# EAGLE design mainboard-raspi-4 (EAGLE 6.4)
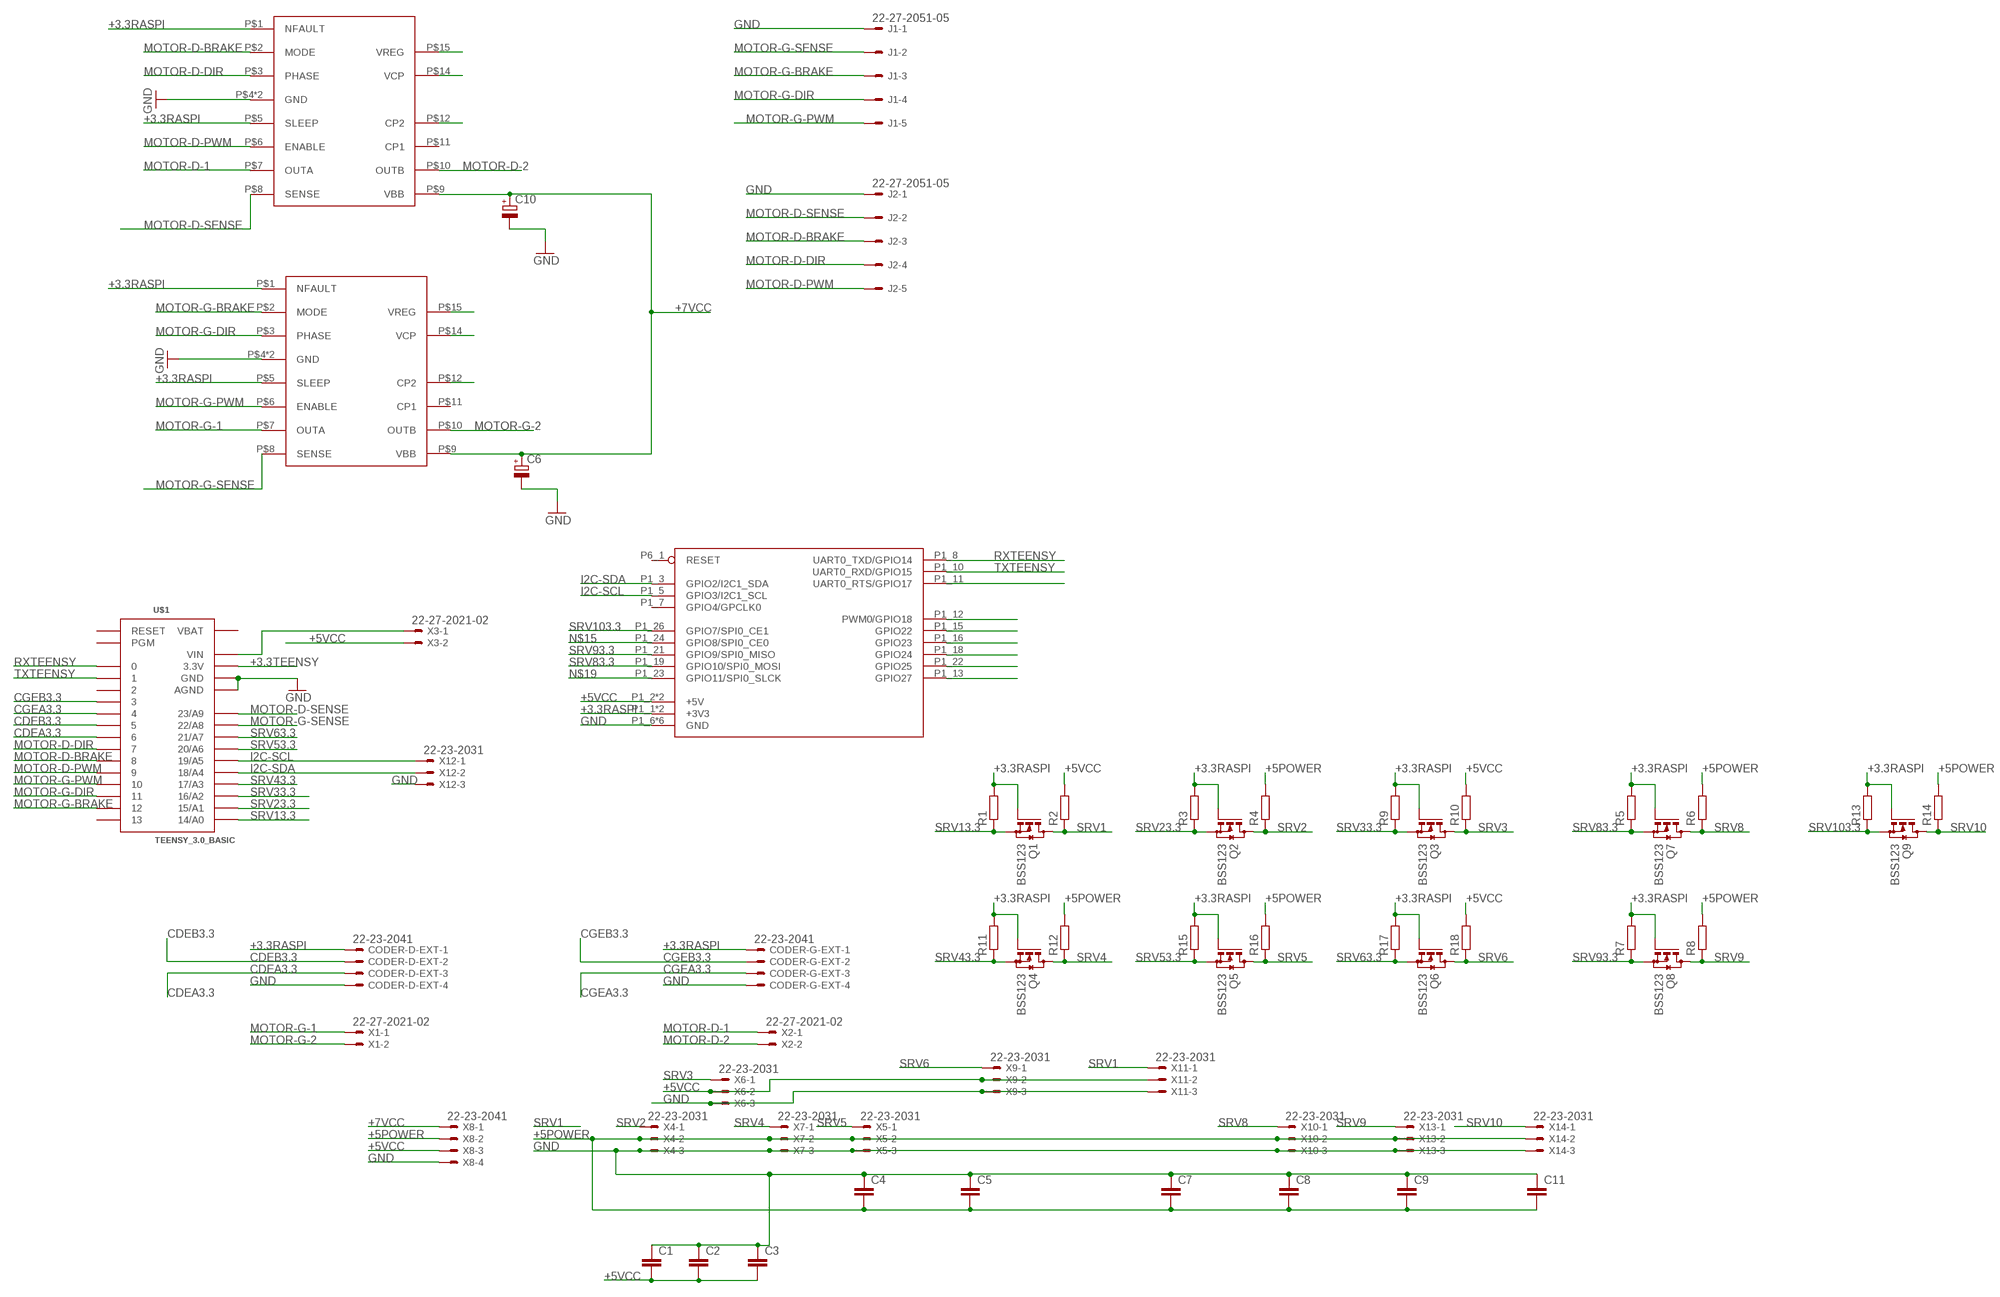
[diagram p0: schematic, sheet 1]

## Parts
C1  C-EUC0603K  [C0603K]
C2  C-EUC0603K  [C0603K]
C3  C-EUC0603K  [C0603K]
C4  C-EUC0603K  [C0603K]
C5  C-EUC0603K  [C0603K]
C6  CPOL-EUE3.5-8  [E3,5-8]
C7  C-EUC0603K  [C0603K]
C8  C-EUC0603K  [C0603K]
C9  C-EUC0603K  [C0603K]
C10  CPOL-EUE3.5-8  [E3,5-8]
C11  C-EUC0603K  [C0603K]
CODER-D-EXT  22-23-2041  [22-23-2041]
CODER-G-EXT  22-23-2041  [22-23-2041]
J1  22-27-2051-05  [6410-05]
J2  22-27-2051-05  [6410-05]
Q1  BSS123  [SOT23]
Q2  BSS123  [SOT23]
Q3  BSS123  [SOT23]
Q4  BSS123  [SOT23]
Q5  BSS123  [SOT23]
Q6  BSS123  [SOT23]
Q7  BSS123  [SOT23]
Q8  BSS123  [SOT23]
Q9  BSS123  [SOT23]
R1  R-EU_R0603  [R0603]
R2  R-EU_R0603  [R0603]
R3  R-EU_R0603  [R0603]
R4  R-EU_R0603  [R0603]
R5  R-EU_R0603  [R0603]
R6  R-EU_R0603  [R0603]
R7  R-EU_R0603  [R0603]
R8  R-EU_R0603  [R0603]
R9  R-EU_R0603  [R0603]
R10  R-EU_R0603  [R0603]
R11  R-EU_R0603  [R0603]
R12  R-EU_R0603  [R0603]
R13  R-EU_R0603  [R0603]
R14  R-EU_R0603  [R0603]
R15  R-EU_R0603  [R0603]
R16  R-EU_R0603  [R0603]
R17  R-EU_R0603  [R0603]
R18  R-EU_R0603  [R0603]
U$1  TEENSY_3.0_BASIC  [TEENSY_3.0_BASIC]
U$2  RPI-B-V2SHIELD  [RPI-B-V2-SHIELD]
U$3  A3950-DIL  [DIL16]
U$4  A3950-DIL  [DIL16]
X1  22-27-2021-02  [6410-02]
X2  22-27-2021-02  [6410-02]
X3  22-27-2021-02  [6410-02]
X4  22-23-2031  [22-23-2031]
X5  22-23-2031  [22-23-2031]
X6  22-23-2031  [22-23-2031]
X7  22-23-2031  [22-23-2031]
X8  22-23-2041  [22-23-2041]
X9  22-23-2031  [22-23-2031]
X10  22-23-2031  [22-23-2031]
X11  22-23-2031  [22-23-2031]
X12  22-23-2031  [22-23-2031]
X13  22-23-2031  [22-23-2031]
X14  22-23-2031  [22-23-2031]

## Nets
+3.3RASPI: CODER-D-EXT.1 CODER-G-EXT.1 Q1.1(G) Q2.1(G) Q3.1(G) Q4.1(G) Q5.1(G) Q6.1(G) Q7.1(G) Q8.1(G) Q9.1(G) R1.2 R3.2 R5.2 R7.2 R9.2 R11.2 R13.2 R15.2 R17.2 U$2.P1_1(+3V3) U$2.P1_17(+3V3) U$3.P$1(NFAULT) U$3.P$5(SLEEP) U$4.P$1(NFAULT) U$4.P$5(SLEEP)
+3.3TEENSY: U$1.3.3V U$1.3.3V1(3.3V)
+5POWER: C4.2 C5.2 C7.2 C8.2 C9.2 C11.2 R4.2 R6.2 R8.2 R12.2 R14.2 R16.2 X4.2 X5.2 X7.2 X8.2 X10.2 X13.2 X14.2
+5VCC: C1.2 C2.2 C3.2 R2.2 R10.2 R18.2 U$2.P1_2(+5V) U$2.P1_4(+5V) X3.2 X6.2 X8.3 X9.2 X11.2
+7VCC: C6.+ C10.+ U$3.P$9(VBB) U$4.P$9(VBB) X8.1
CDEA3.3: CODER-D-EXT.3 U$1.6
CDEB3.3: CODER-D-EXT.2 U$1.5
CGEA3.3: CODER-G-EXT.3 U$1.4
CGEB3.3: CODER-G-EXT.2 U$1.3
GND: C1.1 C2.1 C3.1 C4.1 C5.1 C6.- C7.1 C8.1 C9.1 C10.- C11.1 CODER-D-EXT.4 CODER-G-EXT.4 J1.1 J2.1 U$1.AGND U$1.GND U$1.GND1(GND) U$2.P1_6(GND) U$2.P1_9(GND) U$2.P1_14(GND) U$2.P1_20(GND) U$2.P1_25(GND) U$2.P6_2(GND) U$3.P$4(GND) U$3.P$13(GND) U$4.P$4(GND) U$4.P$13(GND) X4.3 X5.3 X6.3 X7.3 X8.4 X9.3 X10.3 X11.3 X12.3 X13.3 X14.3
I2C-SCL: U$1.19/A5 U$2.P1_5(GPIO3/I2C1_SCL) X12.1
I2C-SDA: U$1.18/A4 U$2.P1_3(GPIO2/I2C1_SDA) X12.2
MOTOR-D-1: U$4.P$7(OUTA) X2.1
MOTOR-D-2: U$4.P$10(OUTB) X2.2
MOTOR-D-BRAKE: J2.3 U$1.8 U$4.P$2(MODE)
MOTOR-D-DIR: J2.4 U$1.7 U$4.P$3(PHASE)
MOTOR-D-PWM: J2.5 U$1.9 U$4.P$6(ENABLE)
MOTOR-D-SENSE: J2.2 U$1.23/A9 U$4.P$8(SENSE)
MOTOR-G-1: U$3.P$7(OUTA) X1.1
MOTOR-G-2: U$3.P$10(OUTB) X1.2
MOTOR-G-BRAKE: J1.3 U$1.12 U$3.P$2(MODE)
MOTOR-G-DIR: J1.4 U$1.11 U$3.P$3(PHASE)
MOTOR-G-PWM: J1.5 U$1.10 U$3.P$6(ENABLE)
MOTOR-G-SENSE: J1.2 U$1.22/A8 U$3.P$8(SENSE)
N$1: U$2.P1_12(PWM0/GPIO18)
N$2: U$2.P1_11(UART0_RTS/GPIO17)
N$3: U$1.VIN X3.1
N$4: U$2.P1_15(GPIO22)
N$5: U$2.P1_16(GPIO23)
N$6: U$2.P1_18(GPIO24)
N$7: U$2.P1_22(GPIO25)
N$8: U$3.P$15(VREG)
N$9: U$3.P$14(VCP)
N$10: U$3.P$12(CP2)
N$11: U$2.P1_13(GPIO27)
N$13: U$4.P$15(VREG)
N$14: U$4.P$14(VCP)
N$15: U$2.P1_24(GPIO8/SPI0_CE0)
N$16: U$4.P$12(CP2)
N$19: U$2.P1_23(GPIO11/SPI0_SLCK)
RXTEENSY: U$1.0 U$2.P1_8(UART0_TXD/GPIO14)
SRV1: Q1.3(D) R2.1 X11.1
SRV2: Q2.3(D) R4.1 X4.1
SRV3: Q3.3(D) R10.1 X6.1
SRV4: Q4.3(D) R12.1 X7.1
SRV5: Q5.3(D) R16.1 X5.1
SRV6: Q6.3(D) R18.1 X9.1
SRV8: Q7.3(D) R6.1 X10.1
SRV9: Q8.3(D) R8.1 X13.1
SRV10: Q9.3(D) R14.1 X14.1
SRV13.3: Q1.2(S) R1.1 U$1.14/A0
SRV23.3: Q2.2(S) R3.1 U$1.15/A1
SRV33.3: Q3.2(S) R9.1 U$1.16/A2
SRV43.3: Q4.2(S) R11.1 U$1.17/A3
SRV53.3: Q5.2(S) R15.1 U$1.20/A6
SRV63.3: Q6.2(S) R17.1 U$1.21/A7
SRV83.3: Q7.2(S) R5.1 U$2.P1_19(GPIO10/SPI0_MOSI)
SRV93.3: Q8.2(S) R7.1 U$2.P1_21(GPIO9/SPI0_MISO)
SRV103.3: Q9.2(S) R13.1 U$2.P1_26(GPIO7/SPI0_CE1)
TXTEENSY: U$1.1 U$2.P1_10(UART0_RXD/GPIO15)
Unconnected: U$1.2 U$1.13 U$1.PGM U$1.RESET U$2.P1_7(GPIO4/GPCLK0) U$3.P$11(CP1) U$4.P$11(CP1)

## Power pins joined to a net without a drawn wire
RESET: U$2.P6_1(RESET)
VBAT: U$1.VBAT

## Library data of the parts
C1-C5 C7-C9 C11 = rcl:C-EU: CAPACITOR, European symbol
C6 C10 = rcl:CPOL-EU: POLARIZED CAPACITOR, European symbol
CODER-D-EXT CODER-G-EXT X8 = con-molex:22-23-2041: .100" (2.54mm) Center Header - 4 Pin; MF: MOLEX; MPN: 22-23-2041; OC_FARNELL: 1462920; OC_NEWARK: 38C0355
J1 J2 = con-molex:22-?-05: CONNECTOR wire to board 2.54 mm (.1 inch) pitch header; OC_FARNELL: unknown; OC_NEWARK: unknown
Q1-Q9 = transistor-small-signal:BSS123: N-CHANNEL MOS FET
R1-R18 = rcl:R-EU_: RESISTOR, European symbol
U$1 = Teensy3.0:TEENSY_3.0_BASIC: Basic Teensy 3.0 with none of the 'inner' pins enabled. See '+4', 'AllAnalogPins", and 'AllPins' packages for additional pin holes, as needed.
U$2 = raspberry:RPI-B-V2: Second revision of the Model 2 board including the P5 and P6 headers. Mounting holes have been added. Choose the "SHIELD" variant for a predefined Dimension layer and drilling holes. Theres also a "SHIELD" variant for the Model A without a RJ45 connector.
U$3 U$4 = A3950:A3950-DIL
X1-X3 = con-molex:22-?-02: CONNECTOR wire to board 2.54 mm (.1 inch) pitch header; OC_FARNELL: unknown; OC_NEWARK: unknown
X4-X7 X9-X14 = con-molex:22-23-2031: .100" (2.54mm) Center Header - 3 Pin; MF: MOLEX; MPN: 22-23-2031; OC_FARNELL: 1462950; OC_NEWARK: 30C0862

## Board
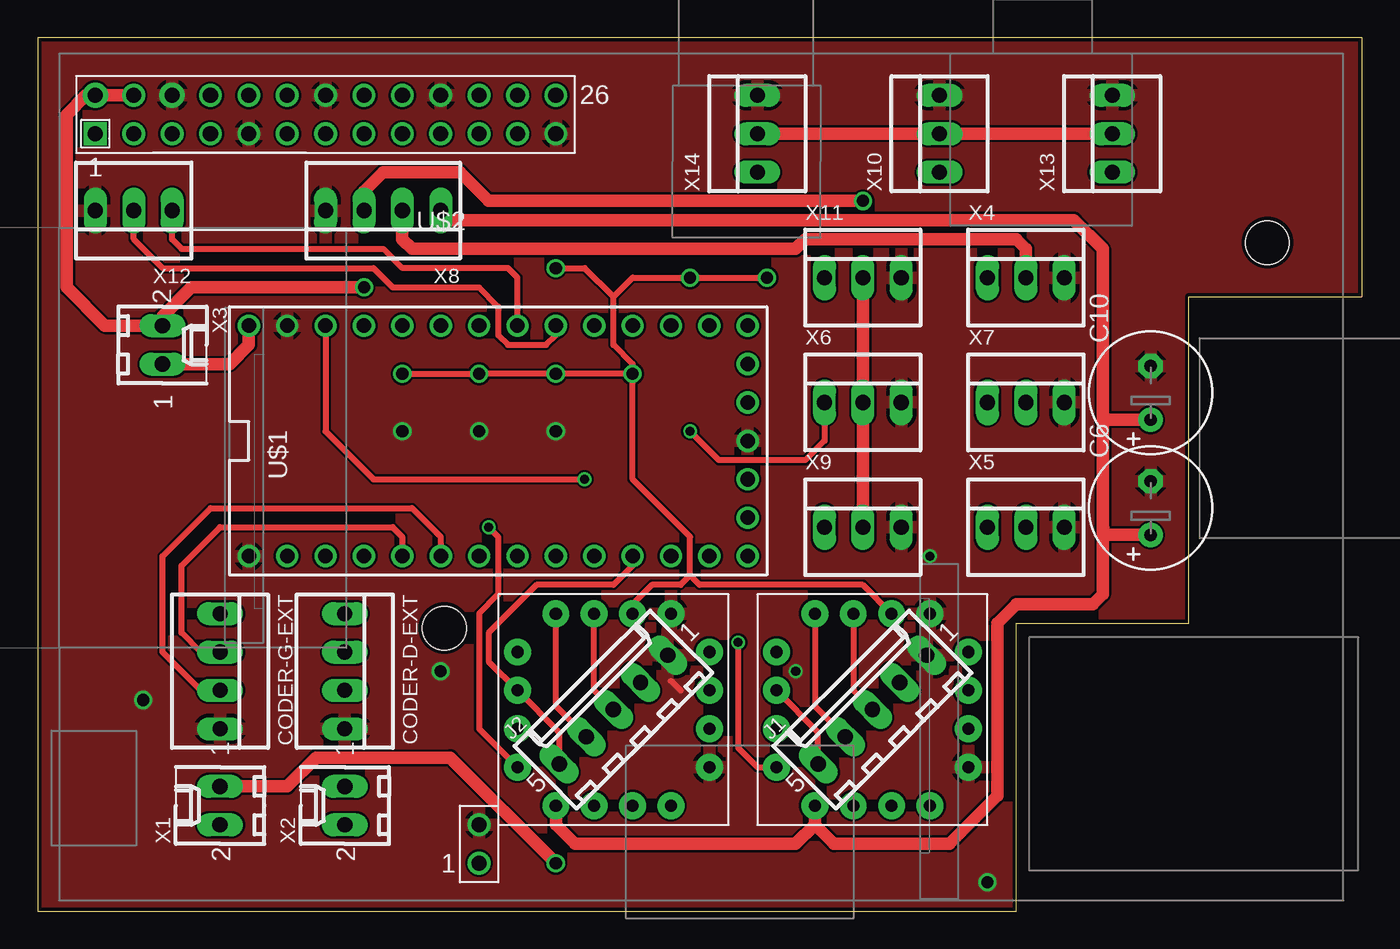
[diagram p1: board, top side]
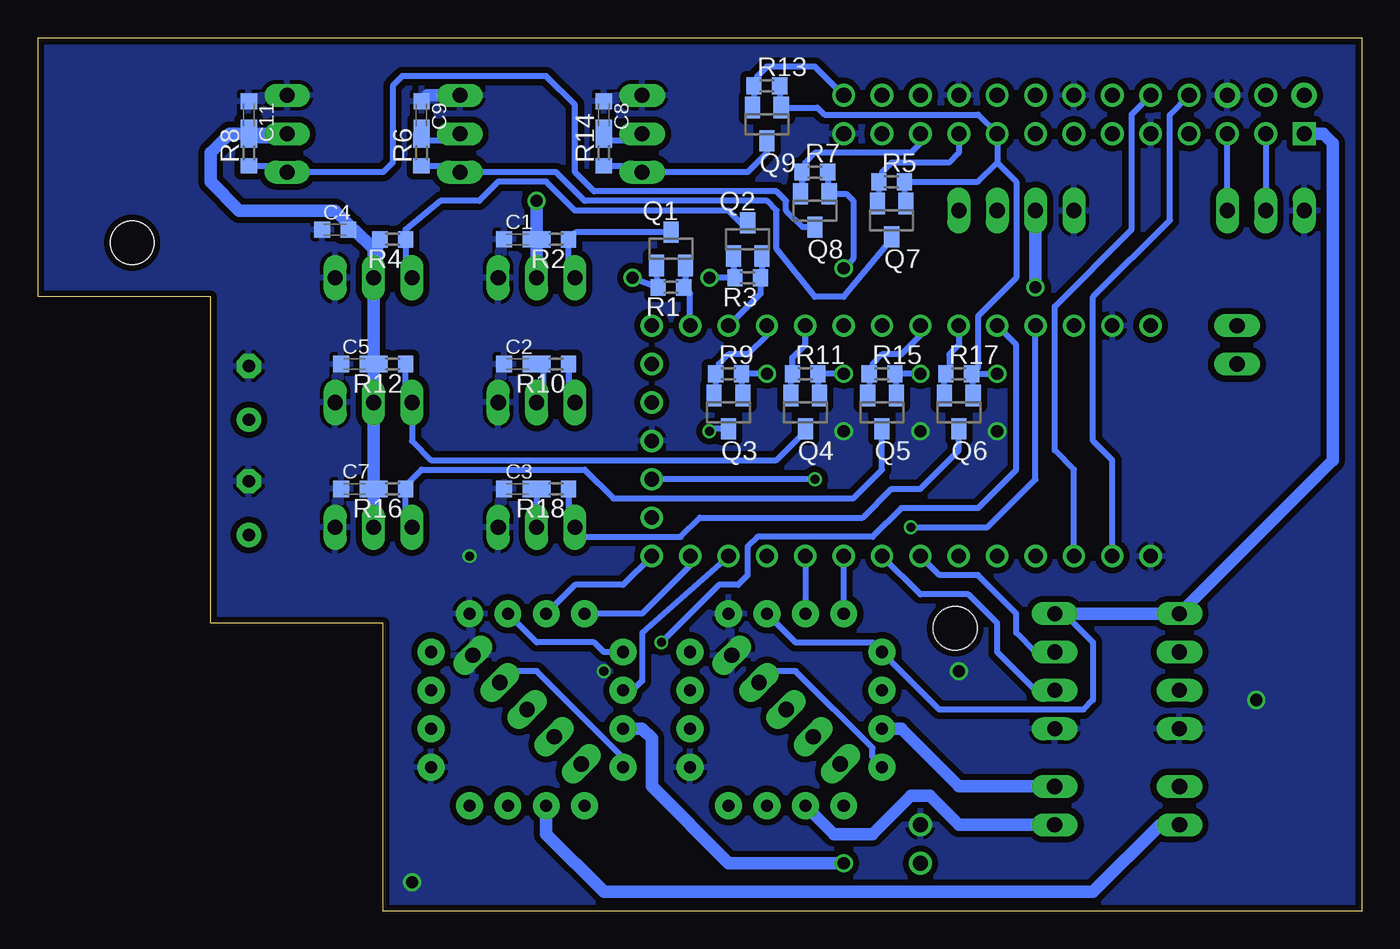
[diagram p2: board, bottom side, seen from below]

Size 87.63 x 57.78 mm. Coordinates in mm from the lower left corner, seen from the top.
Outline: 0,0 64.77,0 64.77,19.05 76.2,19.05 76.2,40.64 87.63,40.64 87.63,57.78 0,57.77 0,0
Copper layers (1*16): Top 0.035mm / dielectric 1.5mm / Bottom 0.035mm
Design rules "SeeedStudio_DRU_no_angle_2layer": minimum track width 6mil, minimum drill 12mil, track to track 6mil, track to pad 6mil, pad to pad 6mil, via to via 6mil, smd to smd 0mil, copper to edge 10mil, drill to drill 10mil, minimum pad ring 10mil, minimum via ring 6mil, stop-mask expansion 2mil, vias tented up to drill 25mil, thermal gap 10mil

### Footprints (pad centres in the part's own frame; a part is rotated, then mirrored left to right if it is on the bottom)
C0603K = smd 1.05 x 1.08: 1 -0.875,0; 2 0.875,0
E3,5-8 = drill 0.813 pad 1.6: + -1.778,0 | drill 0.813 pad 1.6 octagon: - 1.778,0
22-23-2041 = drill 1 long: 1 -3.81,0; 2 -1.27,0; 3 1.27,0; 4 3.81,0
6410-05 = drill 1.016 long: 1 5.08,0; 2 2.54,0; 3 0,0; 4 -2.54,0; 5 -5.08,0
SOT23 = smd 1 x 1.4: 1 -0.95,-1.1; 2 0.95,-1.1; 3 0,1.1
R0603 = smd 1 x 1.1: 1 -0.85,0; 2 0.85,0
TEENSY_3.0_BASIC = drill 0.965: 0 -7.62,13.97; 1 -7.62,11.43; 2 -7.62,8.89; 3 -7.62,6.35; 3.3V 7.62,11.43; 3.3V1 -2.54,-16.51; 4 -7.62,3.81; 5 -7.62,1.27; 6 -7.62,-1.27; 7 -7.62,-3.81; 8 -7.62,-6.35; 9 -7.62,-8.89; 10 -7.62,-11.43; 11 -7.62,-13.97; 12 -7.62,-16.51; 13 7.62,-16.51; 14/A0 7.62,-13.97; 15/A1 7.62,-11.43; 16/A2 7.62,-8.89; 17/A3 7.62,-6.35; 18/A4 7.62,-3.81; 19/A5 7.62,-1.27; 20/A6 7.62,1.27; 21/A7 7.62,3.81; 22/A8 7.62,6.35; 23/A9 7.62,8.89; AGND 7.62,13.97; GND -7.62,16.51; GND1 0,-16.51; PGM 2.54,-16.51; RESET 5.08,-16.51; VBAT -5.08,-16.51; VIN 7.62,16.51
RPI-B-V2-SHIELD = drill 1 square: P1_1 0,0 | drill 1 pad 1.676: P1_2 0,2.54; P1_6 5.08,2.54 | drill 1: P1_3 2.54,0; P1_4 2.54,2.54; P1_5 5.08,0; P1_7 7.62,0; P1_8 7.62,2.54; P1_9 10.16,0; P1_10 10.16,2.54; P1_11 12.7,0; P1_12 12.7,2.54; P1_13 15.24,0; P1_14 15.24,2.54; P1_15 17.78,0; P1_16 17.78,2.54; P1_17 20.32,0; P1_18 20.32,2.54; P1_19 22.86,0; P1_20 22.86,2.54; P1_21 25.4,0; P1_22 25.4,2.54; P1_23 27.94,0; P1_24 27.94,2.54; P1_25 30.48,0; P1_26 30.48,2.54; P6_1 25.4,-48.26; P6_2 25.4,-45.72 | hole 2.9: 23.1,-32.72; 77.57,-7.21
DIL16 = drill 0.8 pad 1.778: P$1 -1.27,-6.35; P$2 1.27,-6.35; P$3 3.81,-6.35; P$4 -3.81,-6.35; P$5 6.35,-3.81; P$6 6.35,-1.27; P$7 6.35,1.27; P$8 6.35,3.81; P$9 3.81,6.35; P$10 1.27,6.35; P$11 -1.27,6.35; P$12 -3.81,6.35; P$13 -6.35,3.81; P$14 -6.35,1.27; P$15 -6.35,-1.27; P$16 -6.35,-3.81
6410-02 = drill 1.016 long: 1 1.27,0; 2 -1.27,0
22-23-2031 = drill 1 long: 1 -2.54,0; 2 0,0; 3 2.54,0

### Placement (x,y rotation side)
C1  55.88,44.45 0 bottom
C2  55.88,36.2 0 bottom
C3  55.88,27.94 0 bottom
C4  67.95,45.08 0 bottom
C5  66.68,36.2 0 bottom
C6  73.66,26.67 90 top
C7  66.68,27.94 0 bottom
C8  50.16,52.7 270 bottom
C9  62.23,52.7 270 bottom
C10  73.66,34.29 90 top
C11  73.66,52.7 270 bottom
CODER-D-EXT  20.32,15.88 270 top
CODER-G-EXT  12.06,15.88 270 top
J1  55.24,13.34 45 top
J2  38.1,13.34 45 top
Q1  45.72,43.81 0 bottom
Q2  40.64,44.45 0 bottom
Q3  41.91,33.02 180 bottom
Q4  36.83,33.02 180 bottom
Q5  31.75,33.02 180 bottom
Q6  26.67,33.02 180 bottom
Q7  31.12,45.72 180 bottom
Q8  36.2,46.36 180 bottom
Q9  39.37,52.07 180 bottom
R1  45.72,41.28 180 bottom
R2  53.34,44.45 180 bottom
R3  40.64,41.91 180 bottom
R4  64.14,44.45 180 bottom
R5  31.12,48.26 0 bottom
R6  62.23,50.16 90 bottom
R7  36.2,48.89 0 bottom
R8  73.66,50.16 90 bottom
R9  41.91,35.56 0 bottom
R10  53.34,36.2 180 bottom
R11  36.83,35.56 0 bottom
R12  64.14,36.2 180 bottom
R13  39.37,54.61 0 bottom
R14  50.16,50.16 90 bottom
R15  31.75,35.56 0 bottom
R16  64.14,27.94 180 bottom
R17  26.67,35.56 0 bottom
R18  53.34,27.94 180 bottom
U$1  30.48,31.11 90 top
U$2  3.81,51.44 0 top
U$3  55.24,13.34 180 top
U$4  38.1,13.34 180 top
X1  12.07,6.98 90 top
X2  20.32,6.99 90 top
X3  8.26,37.47 270 top
X4  65.41,41.91 0 top
X5  65.41,25.4 0 top
X6  54.61,33.66 0 top
X7  65.41,33.66 0 top
X8  22.86,46.36 180 top
X9  54.61,25.4 0 top
X10  59.69,51.44 90 top
X11  54.61,41.91 0 top
X12  6.35,46.35 180 top
X13  71.12,51.44 90 top
X14  47.62,51.44 90 top

### Tracks (layer width: path | path; a pad name or v marks a point on that pad's centre or on a via)
+3.3RASPI  (via drill 0.8)
  Top 0.406: v24.13,35.56 v29.21,35.56 v34.29,35.56 v39.37,35.56 | v48.26,41.91 v43.18,41.91 39.37,41.91 38.1,40.64 | v39.37,35.56 39.37,36.2 38.1,37.47 38.1,40.64 | 43.18,22.22 43.18,24.77 39.37,28.57 v39.37,35.56 | 43.18,22.22 42.55,21.59 40.64,21.59 39.37,20.32 U$4.P$1 | 43.18,22.22 43.81,21.59 54.61,21.59 U$3.P$1 | v34.29,42.55 36.2,42.55 38.1,40.64
  Bottom 0.406: 24.13,49.53 U$2.P1_17 25.4,52.7 35.56,52.7 36.02,53.17 Q9.1 38.52,53.27 R13.2 | 24.13,49.53 22.86,48.26 22.86,41.91 25.4,39.37 25.4,35.98 R17.2 | Q5.1 30.8,35.46 R15.2 v29.21,35.56 | Q6.1 25.72,35.46 R17.2 | R17.2 v24.13,35.56 | v34.29,35.56 R11.2 35.98,34.22 Q4.1 | Q3.1 41.06,34.22 R9.2 v39.37,35.56 | Q1.1 46.67,42.01 R1.2 v48.26,41.91 | Q2.1 41.59,42.01 R3.2 v43.18,41.91 | 19.69,19.68 17.78,17.78 17.78,13.97 18.41,13.34 27.94,13.34 U$4.P$5 32.38,17.78 37.46,17.78 U$4.P$1 | U$3.P$5 50.16,17.14 50.8,17.78 54.61,17.78 U$3.P$1 | Q7.1 30.27,46.92 R5.2 25.4,48.26 24.13,49.53 | R7.2 35.34,46.92 Q8.1 34.12,47.45 33.66,46.99 33.66,43.18 v34.29,42.55
  Bottom 0.813: U$2.P1_1 2.54,51.44 1.91,50.8 1.91,29.85 CODER-G-EXT.1 19.69,19.68 CODER-D-EXT.1
+3.3TEENSY  (via drill 0.6)
  Top 0.406: U$1.3.3V 19.05,31.75 22.23,28.57 v36.2,28.57
  Bottom 0.406: v36.2,28.57 U$1.3.3V1
+5POWER
  Top 0.406: X14.2 49.74,51.44
  Top 0.813: X8.2 24.13,44.45 24.77,43.81 50.16,43.81 50.8,44.45 64.77,44.45 65.41,43.81 X4.2 | X13.2 X10.2 X14.2
  Bottom 0.406: R12.2 65.41,36.2 | R4.2 64.98,42.33 X4.2 | R6.2 60.11,51.02 X10.2 | R8.2 71.54,51.02 X13.2 | R14.2 48.05,51.02 X14.2
  Bottom 0.813: X5.2 65.41,27.94 | 65.41,27.94 X7.2 65.41,36.2 | X13.2 74.93,51.44 76.2,50.16 76.2,48.26 74.3,46.36 67.95,46.36 66.68,45.08 | 66.68,45.08 65.41,43.81 X4.2 65.41,36.61 R12.2 C5.2 | C4.2 66.68,45.08 | C7.2 65.41,27.94 | 65.41,27.94 R16.2 | C8.2 R14.2 | C9.2 R6.2 | C11.2 R8.2
+5VCC  (via drill 0.8)
  Top 0.813: U$2.P1_2 U$2.P1_4 3.18,53.98 1.91,52.7 1.91,41.28 4.45,38.73 X3.2 8.26,39.37 10.16,41.28 v21.59,41.28 | X11.2 X6.2 X9.2 | v54.61,46.99 29.84,46.99 27.94,48.89 22.86,48.89 21.59,47.62 X8.3
  Bottom 0.406: X6.2 54.19,34.08 R10.2 C2.2 | X9.2 54.61,27.52 R18.2 C3.2 | R2.2 C1.2 54.61,44.06
  Bottom 0.813: v21.59,41.28 X8.3 | v54.61,46.99 54.61,44.06 X11.2
+7VCC
  Top 0.813: 70.48,32.39 70.48,43.81 68.58,45.72 27.3,45.72 X8.1 | 70.48,32.39 70.48,25.4 | 70.48,25.4 70.48,20.96 69.85,20.32 64.77,20.32 63.5,19.05 63.5,7.62 60.32,4.45 52.7,4.45 51.43,5.71 | 51.43,5.71 U$3.P$9 | U$4.P$9 34.29,5.71 35.56,4.45 50.16,4.45 51.43,5.71 | C6.+ 70.61,24.89 70.48,25.4 | C10.+ 70.61,32.51 70.48,32.39
CDEA3.3
  Bottom 0.406: CODER-D-EXT.3 21.59,14.61 24.13,17.14 24.13,19.05 26.03,20.96 29.21,20.96 U$1.6
CDEB3.3
  Bottom 0.406: CODER-D-EXT.2 21.59,17.14 22.86,18.42 22.86,19.68 25.4,22.22 27.94,22.22 U$1.5
CGEA3.3
  Top 0.406: CODER-G-EXT.3 10.79,14.61 8.26,17.14 8.26,23.5 11.43,26.67 24.77,26.67 26.67,24.77 U$1.4
CGEB3.3
  Top 0.406: CODER-G-EXT.2 10.79,17.14 9.53,18.42 9.53,22.86 12.06,25.4 23.49,25.4 24.13,24.77 U$1.3
GND  (via drill 0.6 pad 0.61, 0.8 pad 0.61)
  Top 0.406: 41.91,15.24 42.55,14.61
  Bottom 0.813: X10.3 61.84,53.97 C9.1
  other vias: 62.87,1.91 59.05,23.5 26.67,15.88 50.16,15.88 24.13,31.75 29.21,31.75 34.29,31.75 6.99,13.97
  pour Bottom (isolate 0.406): -3.17,57.15 -3.81,-3.17 91.44,-1.9 88.27,57.15
  pour Top: -3.81,57.78 -4.44,57.78 -4.44,-5.71 95.25,-5.08 94.62,-1.27 91.44,58.42 0,59.05 0,58.42
I2C-SCL
  Top 0.406: X12.1 8.89,44.45 9.53,43.81 10.16,43.81 22.86,43.81 24.13,42.55 31.12,42.55 31.75,41.91 U$1.19/A5
  Bottom 0.406: X12.1 U$2.P1_5
I2C-SDA
  Top 0.406: 6.35,44.45 | 6.35,44.45 8.26,42.55 22.23,42.55 23.49,41.28 29.21,41.28 30.48,40 30.48,38.1 31.12,37.47 33.66,37.47 34.29,38.1 U$1.18/A4 | 6.35,44.45 X12.2
  Bottom 0.406: U$2.P1_3 X12.2
MOTOR-D-1
  Bottom 0.813: X2.1 26.67,8.26 30.48,12.07 U$4.P$7
MOTOR-D-2
  Bottom 0.813: X2.2 26.67,5.71 28.57,7.62 29.84,7.62 32.38,5.08 34.92,5.08 U$4.P$10
MOTOR-D-BRAKE
  Top 0.406: J2.3 36.83,14.61 U$4.P$2
  Bottom 0.406: U$1.8 U$4.P$2
MOTOR-D-DIR
  Top 0.406: J2.4 34.29,13.55 U$4.P$3
  Bottom 0.406: U$1.7 U$4.P$3
MOTOR-D-PWM
  Top 0.406: U$1.9 39.37,22.86 38.1,21.59 33.02,21.59 29.84,18.42 29.84,16.51 U$4.P$6 34.51,11.85 J2.5
MOTOR-D-SENSE  (via drill 0.6 pad 0.61)
  Top 0.406: v29.84,25.4 30.48,24.77 30.48,20.96 29.21,19.68 29.21,12.07 U$4.P$8
  Bottom 0.406: v29.84,25.4 24.77,25.4 21.59,28.57 U$1.23/A9 | U$4.P$8 32.38,10.16 32.38,10.8 37.46,15.88 39.37,15.88 39.9,15.35 J2.2
MOTOR-G-1  (via drill 0.8 pad 0.61)
  Top 0.813: X1.1 16.51,8.26 18.41,10.16 27.3,10.16 v34.29,3.18
  Bottom 0.813: v34.29,3.18 41.91,3.18 46.99,8.26 46.99,11.43 47.62,12.07 U$3.P$7
MOTOR-G-2
  Bottom 0.813: X1.2 13.33,5.71 17.78,1.27 50.16,1.27 53.98,5.08 U$3.P$10
MOTOR-G-BRAKE
  Top 0.406: U$3.P$2 53.98,14.61 J1.3
  Bottom 0.406: U$1.12 48.89,21.59 52.07,21.59 U$3.P$2
MOTOR-G-DIR
  Top 0.406: U$3.P$3 51.43,13.55 J1.4
  Bottom 0.406: U$1.11 44.45,22.86 47.62,19.68 U$3.P$3
MOTOR-G-PWM
  Top 0.406: J1.5 51.65,11.85 U$3.P$6
  Bottom 0.406: U$1.10 47.62,18.42 47.62,15.24 48.26,14.61 U$3.P$6
MOTOR-G-SENSE  (via drill 0.6 pad 0.61)
  Top 0.406: v46.35,17.78 46.35,10.8 47.62,9.53 U$3.P$8
  Bottom 0.406: v46.35,17.78 42.55,21.59 41.27,21.59 40.64,22.22 40.64,24.13 40,24.77 32.38,24.77 30.48,26.67 25.4,26.67 22.86,29.21 22.86,37.47 U$1.22/A8 | U$3.P$8 48.89,10.16 54.61,15.88 56.3,15.88 J1.2
N$3
  Top 0.813: X3.1 12.7,36.2 13.97,37.47 U$1.VIN
RXTEENSY
  Bottom 0.406: U$1.0 16.51,29.85 17.78,31.11 17.78,40.64 12.7,45.72 12.7,52.71 U$2.P1_8
SRV1
  Bottom 0.406: X11.1 52.49,42.33 R2.1 52.02,44.91 Q1.3
SRV2
  Bottom 0.406: X4.1 63.29,42.33 R4.1 63.29,45.08 60.96,46.99 58.42,46.99 57.15,48.26 53.98,48.26 52.07,46.36 41.91,46.36 40.64,45.08 Q2.3 40.64,45.72
SRV3  (via drill 0.6)
  Top 0.406: X6.1 52.07,31.11 50.8,29.85 45.09,29.85 v43.18,31.75
  Bottom 0.406: R10.1 52.49,34.08 X6.1 | Q3.3 43.01,31.92 v43.18,31.75
SRV4
  Bottom 0.406: R12.1 63.29,34.08 X7.1 62.87,31.11 61.59,29.85 38.73,29.85 36.83,31.75 Q4.3
SRV5
  Bottom 0.406: X5.1 63.29,25.82 R16.1 63.29,28.16 62.23,29.21 51.43,29.21 49.53,27.31 33.66,27.31 31.75,29.21 Q5.3
SRV6
  Bottom 0.406: R18.1 52.49,25.82 X9.1 51.43,24.77 45.09,24.77 43.81,26.04 33.02,26.04 31.12,27.94 29.21,27.94 26.67,30.48 Q6.3
SRV8
  Bottom 0.406: Q7.3 31.12,44.45 34.29,40.64 36.2,40.64 38.73,43.81 38.73,46.36 39.37,46.99 51.43,46.99 53.34,48.89 X10.1 60.11,49.31 R6.1
SRV9
  Bottom 0.406: Q8.3 37,45.25 38.1,46.36 38.1,46.99 38.73,47.62 50.8,47.62 52.07,48.89 52.07,53.34 53.98,55.25 63.5,55.25 64.14,54.61 64.14,49.53 64.77,48.89 X13.1 71.54,49.31 R8.1
SRV10
  Bottom 0.406: Q9.3 39.37,50.16 40.64,48.89 X14.1 48.05,49.31 R14.1
SRV13.3
  Bottom 0.406: U$1.14/A0 44.45,40.86 R1.1 44.77,42.01 Q1.2
SRV23.3
  Bottom 0.406: U$1.15/A1 39.79,40.86 R3.1 39.69,42.01 Q2.2
SRV33.3
  Bottom 0.406: U$1.16/A2 39.37,38.1 40.64,36.83 41.91,36.83 42.55,36.2 42.55,35.78 R9.1 42.76,34.22 Q3.2
SRV43.3
  Bottom 0.406: Q4.2 37.78,35.46 R11.1 37.68,36.61 36.83,37.47 U$1.17/A3
SRV53.3
  Bottom 0.406: Q5.2 32.6,34.22 R15.1 32.38,35.78 32.38,36.2 31.75,36.83 30.48,36.83 29.21,38.1 U$1.20/A6
SRV63.3
  Bottom 0.406: U$1.21/A7 26.67,37.47 27.3,36.83 27.3,35.78 R17.1 27.62,35.46 Q6.2
SRV83.3
  Bottom 0.406: U$2.P1_19 26.67,50.16 27.3,49.53 31.12,49.53 31.75,48.89 31.75,48.47 R5.1 31.96,46.92 Q7.2
SRV93.3
  Bottom 0.406: Q8.2 37.05,46.92 R7.1 36.83,48.47 36.83,49.53 36.2,50.16 29.84,50.16 29.21,50.8 U$2.P1_21
SRV103.3
  Bottom 0.406: Q9.2 40.22,53.27 R13.1 40,54.83 40,55.25 39.37,55.88 36.2,55.88 U$2.P1_26
TXTEENSY
  Bottom 0.406: U$1.1 19.05,29.21 20.32,30.48 20.32,40 15.24,45.08 15.24,52.71 U$2.P1_10